# Altium schematic sheet программатор_мк.SchDoc
size 420 x 297 mm; SheetNumber: 5; SheetTotal: 6
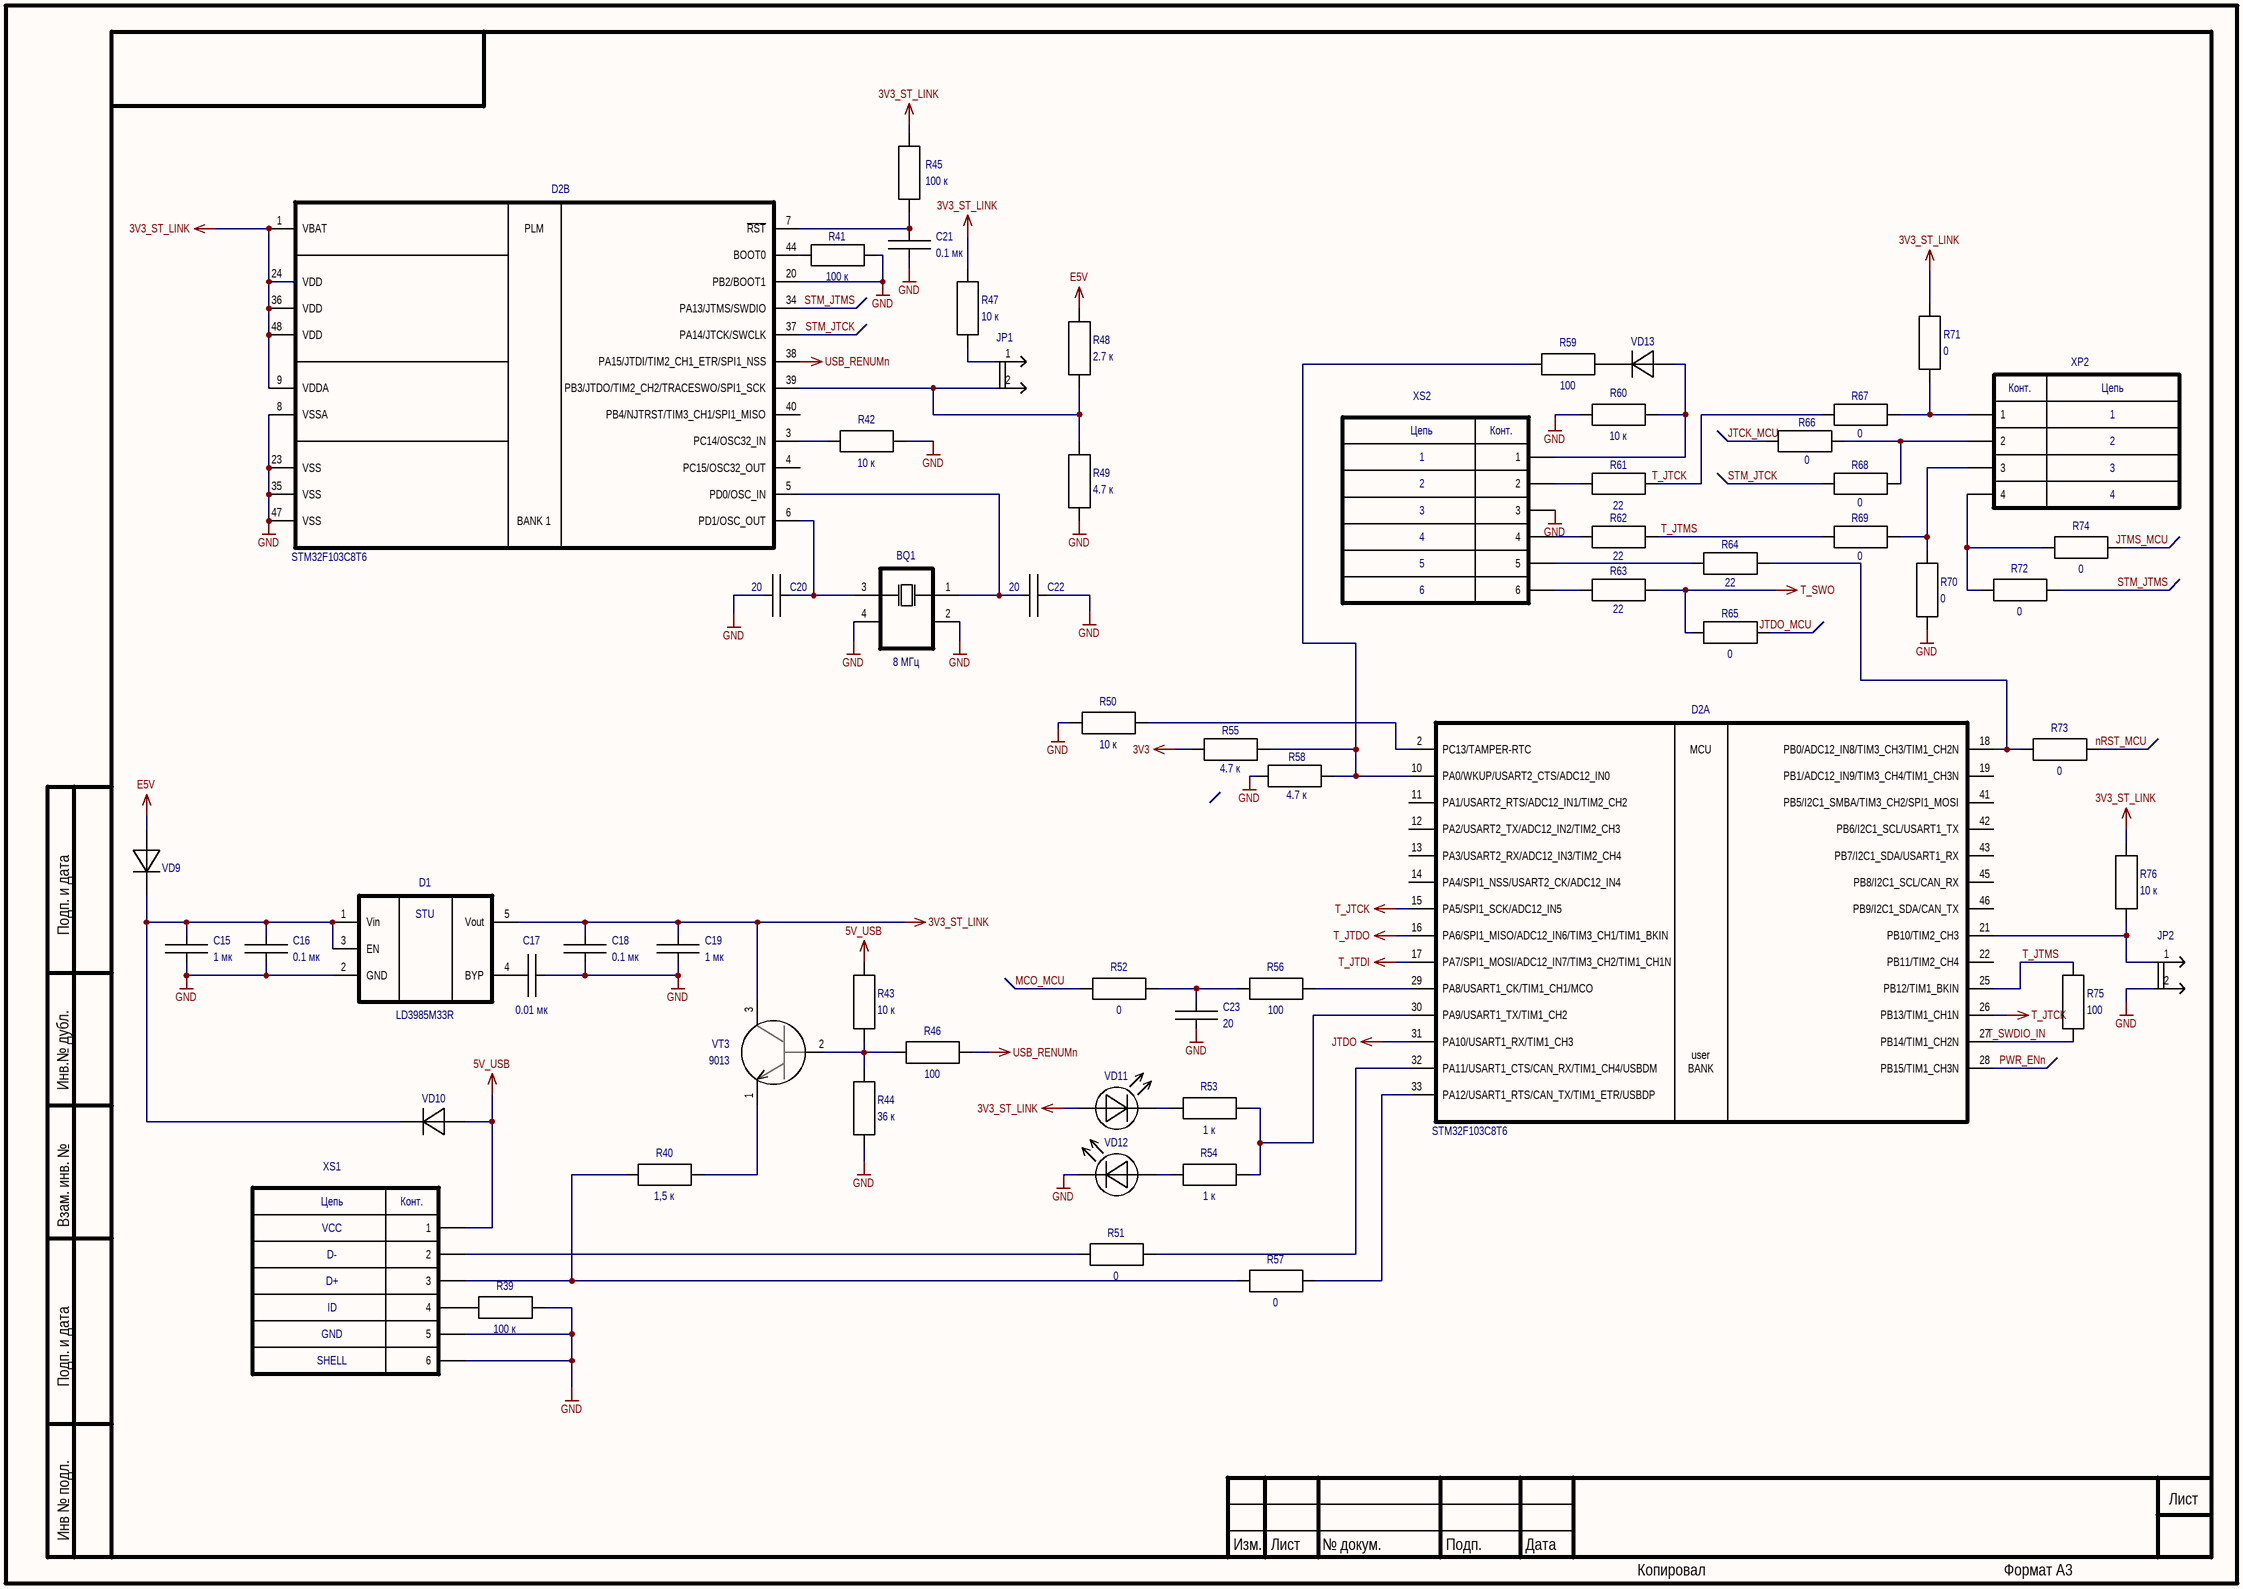
[diagram p0: программатор_мк.SchDoc]

## Parts
BQ1  value 8 МГц  [SMD3225_4P20MHZ20PF10PPM]  (hidden comment: кварцевый резонатор_1)
C15  value 1 мк  [K10-79_1.6_0.8(0603)]  (hidden comment: 1 мкФ ±* * * *, *)
C16  value 0.1 мк  [K10-79_1.6_0.8(0603)]  (hidden comment: 0.1 мкФ ±* * * *, *)
C17  value 0.01 мк  [K10-79_1.6_0.8(0603)]  (hidden comment: 0.01 мкФ ±* * * *, *)
C18  value 0.1 мк  [K10-79_1.6_0.8(0603)]  (hidden comment: 0.1 мкФ ±* * * *, *)
C19  value 1 мк  [K10-79_1.6_0.8(0603)]  (hidden comment: 1 мкФ ±* * * *, *)
C20  value 20  [K10-79_1.6_0.8(0603)]  (hidden comment: 20Ф ±* * * *, *)
C21  value 0.1 мк  [K10-79_1.6_0.8(0603)]  (hidden comment: 0.1 мкФ ±* * * *, *)
C22  value 20  [K10-79_1.6_0.8(0603)]  (hidden comment: 20Ф ±* * * *, *)
C23  value 20  [K10-79_1.6_0.8(0603)]  (hidden comment: 20Ф ±* * * *, *)
D1  value LD3985M33R  [SOT-23-5]  (hidden comment: LT1761ES5-2.5 (TSOT-23) Linear Technology)
D2  value STM32F103C8T6  [LQFP48]  (parts A,B of 2)
JP1  * (*) *  (value not drawn)
JP2  * (*) *  (value not drawn)
R39  value 100 к  [RES 0603]
R40  value 1,5 к  [RES 0603]
R41  value 100 к  [RES 0603]
R42  value 10 к  [RES 0603]
R43  value 10 к  [RES 0603]
R44  value 36 к  [RES 0603]
R45  value 100 к  [RES 0603]
R46  value 100  [RES 0603]
R47  value 10 к  [RES 0603]
R48  value 2.7 к  [RES 0603]
R49  value 4.7 к  [RES 0603]
R50  value 10 к  [RES 0603]
R51  value 0  [RES 0603]
R52  value 0  [RES 0603]
R53  value 1 к  [RES 0603]
R54  value 1 к  [RES 0603]
R55  value 4.7 к  [RES 0603]
R56  value 100  [RES 0603]
R57  value 0  [RES 0603]
R58  value 4.7 к  [RES 0603]
R59  value 100  [RES 0603]
R60  value 10 к  [RES 0603]
R61  value 22  [RES 0603]
R62  value 22  [RES 0603]
R63  value 22  [RES 0603]
R64  value 22  [RES 0603]
R65  value 0  [RES 0603]
R66  value 0  [RES 0603]
R67  value 0  [RES 0603]
R68  value 0  [RES 0603]
R69  value 0  [RES 0603]
R70  value 0  [RES 0603]
R71  value 0  [RES 0603]
R72  value 0  [RES 0603]
R73  value 0  [RES 0603]
R74  value 0  [RES 0603]
R75  value 100  [RES 0603]
R76  value 10 к  [RES 0603]
VD9  BAS316  [SOD-323]  (value not drawn)
VD10  BAS316  [SOD323]  (value not drawn)
VD11  Светодиод  [LED 0603]  (value not drawn)
VD12  Светодиод  [LED 0603]  (value not drawn)
VD13  BAS316  [SOD-323]  (value not drawn)
VT3  value 9013  [SOT23(KT-46)]  (hidden comment: BC847C (SOT-23) NXP)
XP2  KONT_POLE_4  [PLS-4]  (value not drawn)
XS1  1: VCC  3: D+  2: D-  4: ID  6: SHELL  5: GND  [MICRO_USB]  (hidden comment: KONT_POLE_USB_DBG)
XS2  KONT_POLE_USB_DBG  [PBS-6]  (value not drawn)

## Nets
3V3: R55.1
3V3_ST_LINK: C18.2 C19.2 D1.5(Vout) D2.1(VBAT) D2.9(VDDA) D2.24(VDD) D2.36(VDD) D2.48(VDD) R45.2 R47.1 R71.1 R76.1 VD11.1(A) VT3.3
5V_USB: R43.1 VD10.1 XS1.1
E5V: R48.1 VD9.1
GND: BQ1.2(GND) BQ1.4(GND) C15.1 C16.1 C17.1 C18.1 C19.1 C20.2 C21.1 C22.1 C23.2 D1.2(GND) D2.8(VSSA) D2.20(PB2/BOOT1) D2.23(VSS) D2.35(VSS) D2.47(VSS) JP2.2 R39.2 R41.2 R42.1 R44.2 R49.2 R50.1 R58.1 R60.2 R70.2 VD12.2(C) XS1.5 XS1.6 XS2.3
JTDO: D2.31(PA10/USART1_RX/TIM1_CH3)
T_JTCK: D2.15(PA5/SPI1_SCK/ADC12_IN5) D2.26(PB13/TIM1_CH1N) R61.2 R67.2
T_JTDI: D2.17(PA7/SPI1_MOSI/ADC12_IN7/TIM3_CH2/TIM1_CH1N)
T_JTDO: D2.16(PA6/SPI1_MISO/ADC12_IN6/TIM3_CH1/TIM1_BKIN)
T_SWO: R63.2 R65.1
USB_RENUMn: D2.38(PA15/JTDI/TIM2_CH1_ETR/SPI1_NSS) R46.2
JTCK_MCU: R66.1
JTDO_MCU: R65.2
JTMS_MCU: R74.1
MCO_MCU: R52.1
nRST_MCU: R73.2
PWR_ENn: D2.28(PB15/TIM1_CH3N)
STM_JTCK: D2.37(PA14/JTCK/SWCLK) R68.2
STM_JTMS: D2.34(PA13/JTMS/SWDIO) R72.1
T_JTMS: D2.25(PB12/TIM1_BKIN) R62.2 R69.1 R75.1
T_SWDIO_IN: D2.27(PB14/TIM1_CH2N) R75.2
NetBQ1_1: BQ1.1 C22.2 D2.5(PD0/OSC_IN)
NetBQ1_3: BQ1.3 C20.1 D2.6(PD1/OSC_OUT)
NetC15_2: C15.2 C16.2 D1.1(Vin) D1.3(EN) VD9.2 VD10.2
NetC17_2: C17.2 D1.4(BYP)
NetC21_2: C21.2 D2.7(~{RST}) R45.1
NetC23_1: C23.1 R52.2 R56.1
NetD2_2: D2.2(PC13/TAMPER-RTC) R50.2
NetD2_3: D2.3(PC14/OSC32_IN) R42.2
NetD2_10: D2.10(PA0/WKUP/USART2_CTS/ADC12_IN0) R55.2 R58.2 R59.2
NetD2_18: D2.18(PB0/ADC12_IN8/TIM3_CH3/TIM1_CH2N) R64.2 R73.1
NetD2_21: D2.21(PB10/TIM2_CH3) JP2.1 R76.2
NetD2_29: D2.29(PA8/USART1_CK/TIM1_CH1/MCO) R56.2
NetD2_30: D2.30(PA9/USART1_TX/TIM1_CH2) R53.2 R54.2
NetD2_32: D2.32(PA11/USART1_CTS/CAN_RX/TIM1_CH4/USBDM) R51.2
NetD2_33: D2.33(PA12/USART1_RTS/CAN_TX/TIM1_ETR/USBDP) R57.2
NetD2_39: D2.39(PB3/JTDO/TIM2_CH2/TRACESWO/SPI1_SCK) JP1.2 R48.2 R49.1
NetD2_44: D2.44(BOOT0) R41.1
NetJP1_1: JP1.1 R47.2
NetR39_1: R39.1 XS1.4
NetR40_1: R40.1 R57.1 XS1.3
NetR40_2: R40.2 VT3.1
NetR43_2: R43.2 R44.1 R46.1 VT3.2
NetR51_1: R51.1 XS1.2
NetR53_1: R53.1 VD11.2(C)
NetR54_1: R54.1 VD12.1(A)
NetR59_1: R59.1 VD13.2
NetR60_1: R60.1 VD13.1 XS2.1
NetR61_1: R61.1 XS2.2
NetR62_1: R62.1 XS2.4
NetR63_1: R63.1 XS2.6
NetR64_1: R64.1 XS2.5
NetR66_2: R66.2 R68.1 XP2.2
NetR67_1: R67.1 R71.2 XP2.1
NetR69_2: R69.2 R70.1 XP2.3
NetR72_2: R72.2 R74.2 XP2.4

Not connected (* = marked no-connect by the designer): D2 4(PC15/OSC32_OUT) 11(PA1/USART2_RTS/ADC12_IN1/TIM2_CH2) 12(PA2/USART2_TX/ADC12_IN2/TIM2_CH3) 13(PA3/USART2_RX/ADC12_IN3/TIM2_CH4) 14(PA4/SPI1_NSS/USART2_CK/ADC12_IN4) 19(PB1/ADC12_IN9/TIM3_CH4/TIM1_CH3N) 22(PB11/TIM2_CH4) 40(PB4/NJTRST/TIM3_CH1/SPI1_MISO) 41(PB5/I2C1_SMBA/TIM3_CH2/SPI1_MOSI) 42(PB6/I2C1_SCL/USART1_TX) 43(PB7/I2C1_SDA/USART1_RX) 45(PB8/I2C1_SCL/CAN_RX) 46(PB9/I2C1_SDA/CAN_TX)

## Notes on the sheet
- Подп. и дата
- Инв.№ дубл.
- Взам. инв. №
- Инв № подл.
- Изм.
- Лист
- № докум.
- Подп.
- Дата
- Копировал
- Формат А3
- (in symbol KONT_POLE_4) Конт.; Цепь
- (in symbol KONT_POLE_USB_DBG) Цепь; Конт.
- (in symbol LD3985M33R) STU
- (in symbol stm32f103c8t6, part A) MCU; user; BANK
- (in symbol stm32f103c8t6, part B) PLM; BANK 1

## Library data of the parts
BQ1 = кварцевый резонатор_1: PartNumber: MQ-12.000-18; Company: Mercury; Package: 0705
C15-C23 = C: Company: *; PartNumber: *; Tolerance: *; Voltage: *; Type: *; Package: *
D1 = LD3985M33R: Company: Linear Technology; PartNumber: LT1761ES5-2.5; Package: TSOT-23
D2 = stm32f103c8t6: Company: Xilinx; PurtNamber: XC6SLX25-2FGG484C; Package: LQFP-48
JP1 JP2 = JP2_vertical: Company: *; PartNumber: *; Package: *; Value: *
R39-R42 R45 R46 R50-R69 R72-R74 = R: Company: *; PartNumber: *; Package: *; Tolerance: *
R43 R44 R47-R49 R70 R71 R75 R76 = R_1: Company: *; PartNumber: *; Package: *; Tolerance: *
VD9 VD10 VD13 = BAS316: Company: NXP; PartNumber: BAS316; Package: SOD-323; Value: BAS316
VT3 = T!9013: Package: SOT-23; PartNumber: BC847C; Company: NXP
XP2 = KONT_POLE_4: 1: 1; 2: 2; 3: 3; 4: 4
XS1 XS2 = KONT_POLE_USB_DBG
  XS2: 1: 1; 3: 3; 2: 2; 4: 4; 6: 6; 5: 5